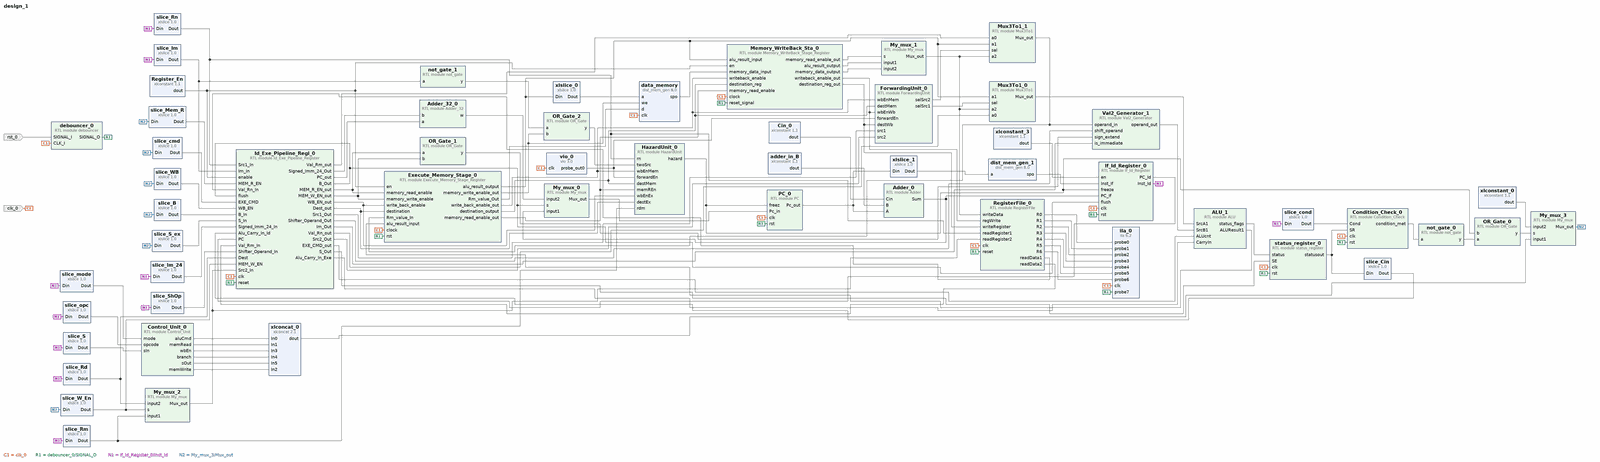
[diagram p0: block diagram of the top level, whole]
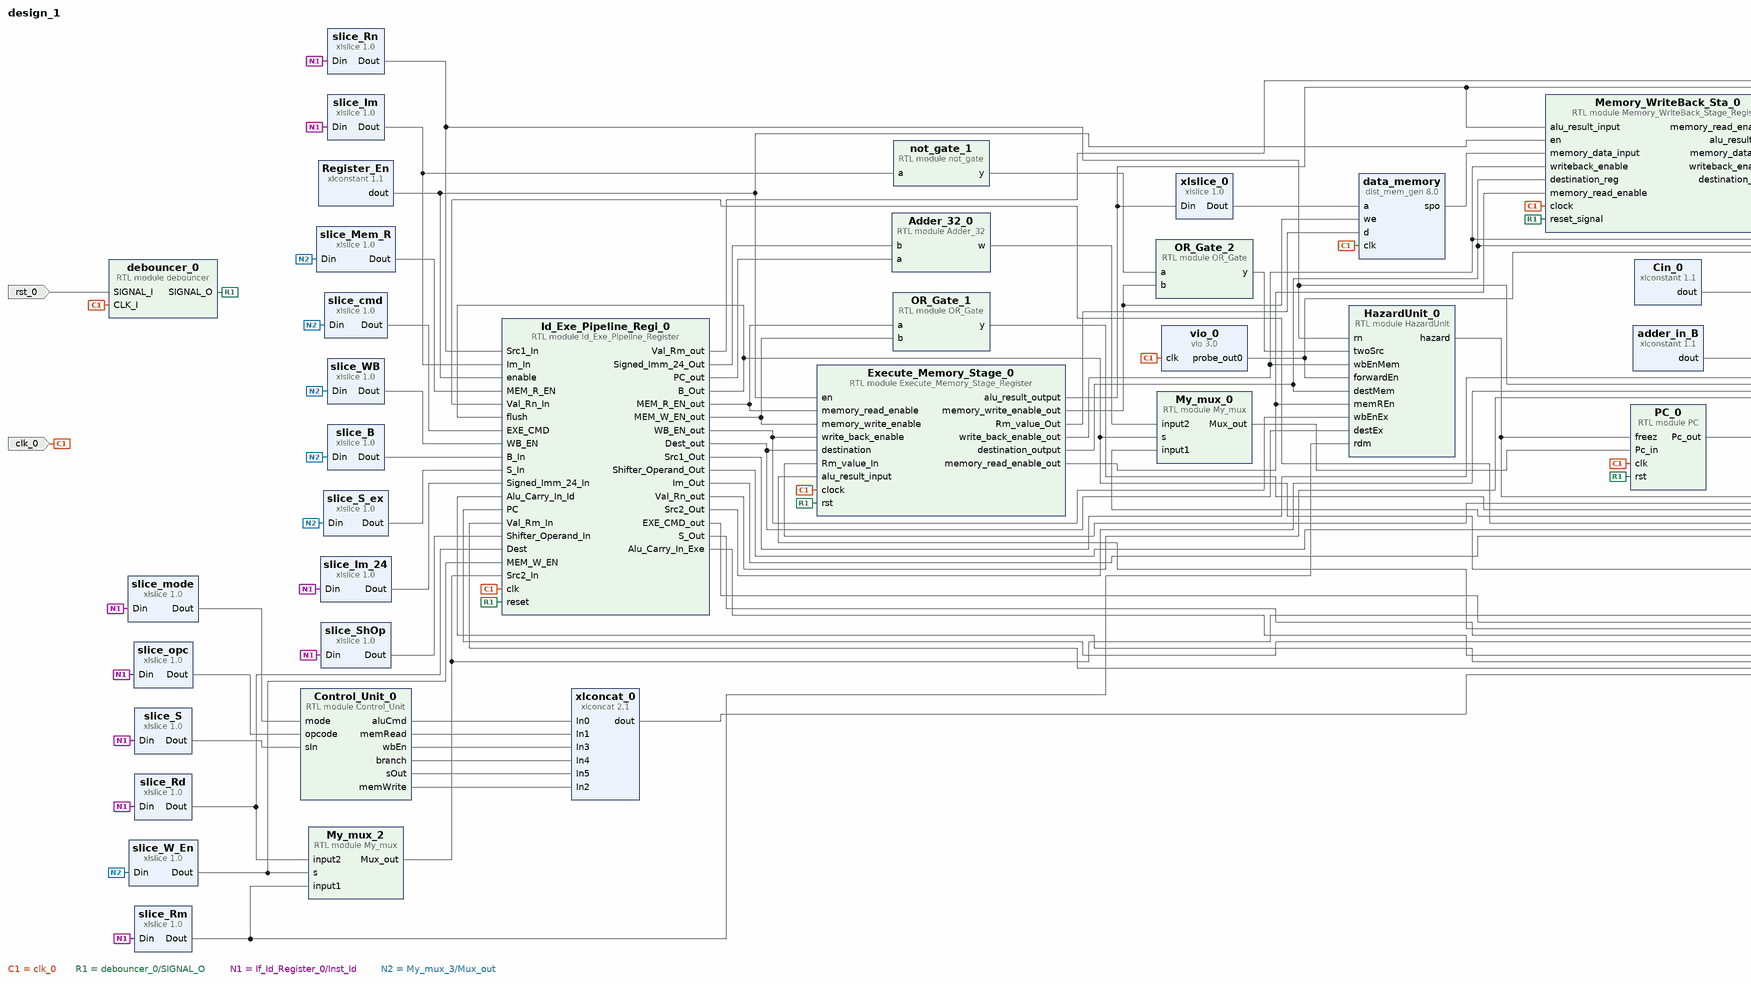
[diagram p1: block diagram of the top level, left part]
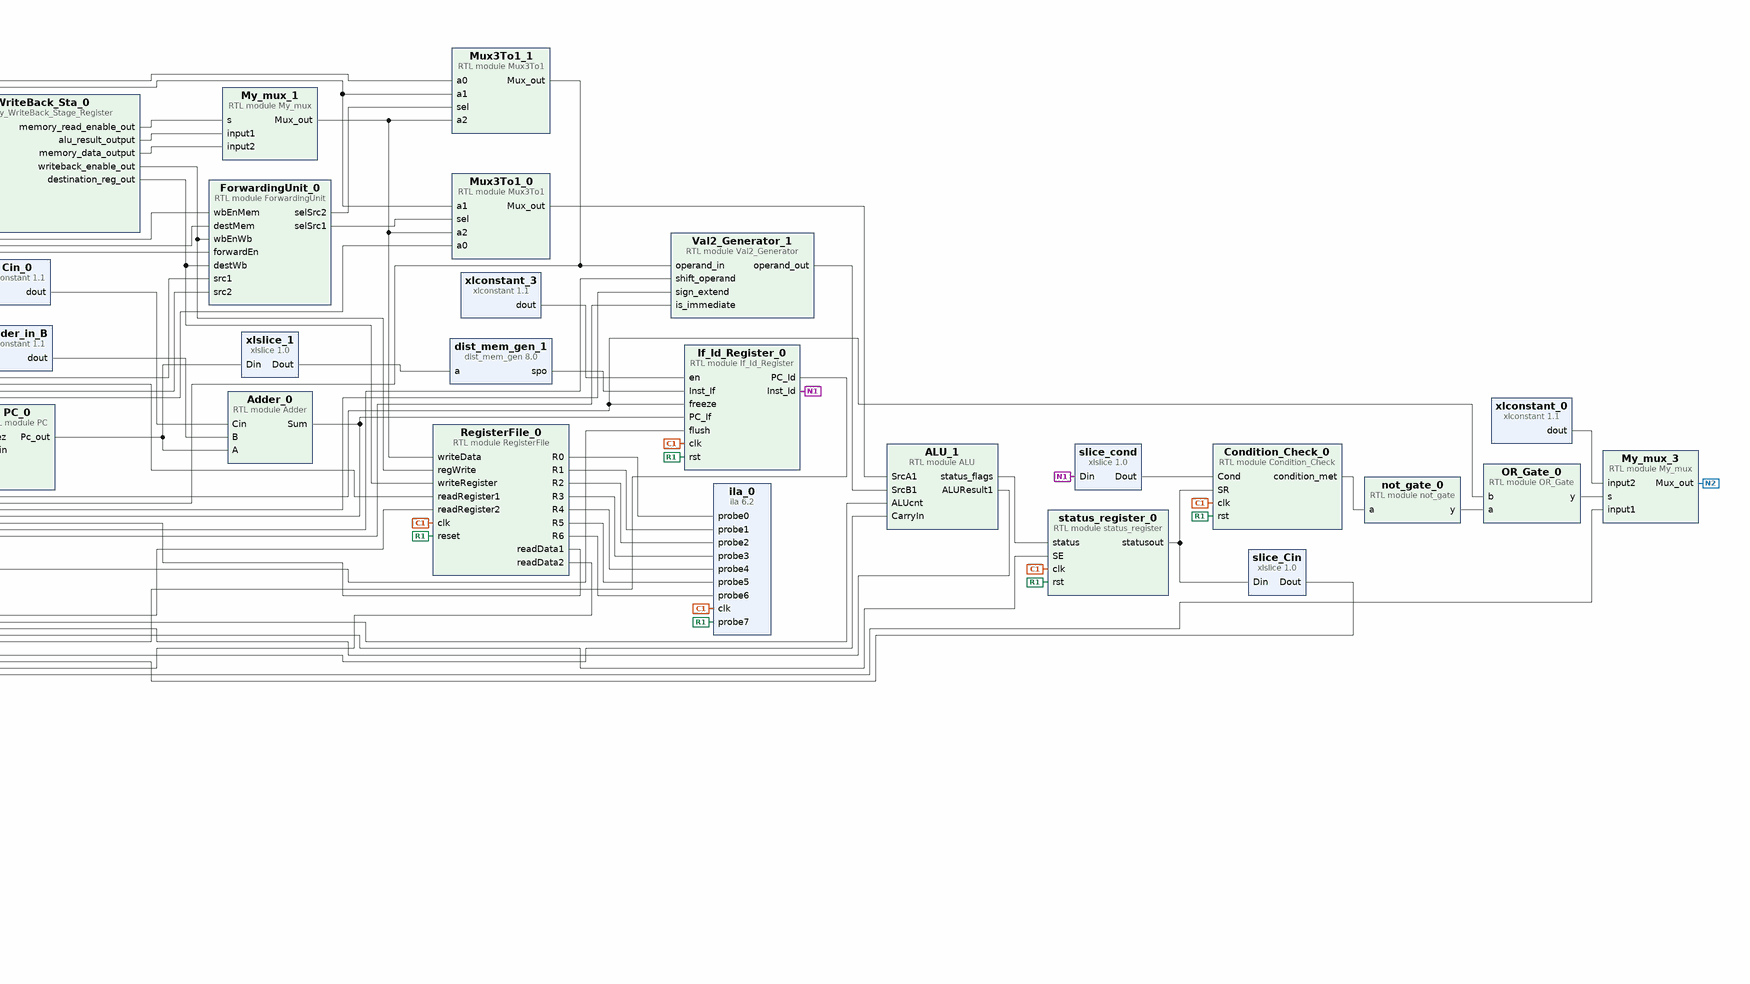
[diagram p2: block diagram of the top level, right part]
# Vivado block design design_1, xc7z010clg400-1, Vivado 2018.3
create_bd_design design_1

create_bd_port -dir I -type clk clk_0
set_property -dict {CONFIG.ASSOCIATED_RESET rst_0} [get_bd_ports clk_0]
create_bd_port -dir I -type rst rst_0

create_bd_cell -type ip -vlnv xilinx.com:ip:xlconstant:1.1 xlconstant_3
create_bd_cell -type ip -vlnv xilinx.com:ip:xlslice:1.0 slice_mode
set_property -dict {CONFIG.DIN_FROM 27 CONFIG.DIN_TO 26 CONFIG.DOUT_WIDTH 2} [get_bd_cells slice_mode]
create_bd_cell -type ip -vlnv xilinx.com:ip:xlslice:1.0 slice_opc
set_property -dict {CONFIG.DIN_FROM 24 CONFIG.DIN_TO 21 CONFIG.DOUT_WIDTH 4} [get_bd_cells slice_opc]
create_bd_cell -type ip -vlnv xilinx.com:ip:xlslice:1.0 slice_S
set_property -dict {CONFIG.DIN_FROM 20 CONFIG.DIN_TO 20 CONFIG.DOUT_WIDTH 1} [get_bd_cells slice_S]
create_bd_cell -type module -reference status_register status_register_0
create_bd_cell -type ip -vlnv xilinx.com:ip:xlslice:1.0 slice_cond
set_property -dict {CONFIG.DIN_FROM 31 CONFIG.DIN_TO 28 CONFIG.DOUT_WIDTH 4} [get_bd_cells slice_cond]
create_bd_cell -type ip -vlnv xilinx.com:ip:xlslice:1.0 slice_Rn
set_property -dict {CONFIG.DIN_FROM 19 CONFIG.DIN_TO 16 CONFIG.DOUT_WIDTH 4} [get_bd_cells slice_Rn]
create_bd_cell -type ip -vlnv xilinx.com:ip:xlslice:1.0 slice_Rd
set_property -dict {CONFIG.DIN_FROM 15 CONFIG.DIN_TO 12 CONFIG.DOUT_WIDTH 4} [get_bd_cells slice_Rd]
create_bd_cell -type ip -vlnv xilinx.com:ip:xlconstant:1.1 xlconstant_0
set_property -dict {CONFIG.CONST_VAL 0 CONFIG.CONST_WIDTH 9} [get_bd_cells xlconstant_0]
create_bd_cell -type ip -vlnv xilinx.com:ip:xlconcat:2.1 xlconcat_0
set_property -dict {CONFIG.IN0_WIDTH 4 CONFIG.NUM_PORTS 6} [get_bd_cells xlconcat_0]
create_bd_cell -type module -reference not_gate not_gate_0
create_bd_cell -type module -reference OR_Gate OR_Gate_0
create_bd_cell -type ip -vlnv xilinx.com:ip:xlslice:1.0 slice_Im_24
set_property -dict {CONFIG.DIN_FROM 23 CONFIG.DOUT_WIDTH 24} [get_bd_cells slice_Im_24]
create_bd_cell -type module -reference OR_Gate OR_Gate_1
create_bd_cell -type ip -vlnv xilinx.com:ip:xlslice:1.0 slice_W_En
set_property -dict {CONFIG.DIN_FROM 5 CONFIG.DIN_TO 5 CONFIG.DIN_WIDTH 9 CONFIG.DOUT_WIDTH 1} [get_bd_cells slice_W_En]
create_bd_cell -type ip -vlnv xilinx.com:ip:xlslice:1.0 slice_cmd
set_property -dict {CONFIG.DIN_FROM 3 CONFIG.DIN_TO 0 CONFIG.DIN_WIDTH 9 CONFIG.DOUT_WIDTH 4} [get_bd_cells slice_cmd]
create_bd_cell -type ip -vlnv xilinx.com:ip:xlslice:1.0 slice_S_ex
set_property -dict {CONFIG.DIN_FROM 8 CONFIG.DIN_TO 8 CONFIG.DIN_WIDTH 9 CONFIG.DOUT_WIDTH 1} [get_bd_cells slice_S_ex]
create_bd_cell -type ip -vlnv xilinx.com:ip:xlslice:1.0 slice_B
set_property -dict {CONFIG.DIN_FROM 7 CONFIG.DIN_TO 7 CONFIG.DIN_WIDTH 9 CONFIG.DOUT_WIDTH 1} [get_bd_cells slice_B]
create_bd_cell -type ip -vlnv xilinx.com:ip:xlslice:1.0 slice_WB
set_property -dict {CONFIG.DIN_FROM 6 CONFIG.DIN_TO 6 CONFIG.DIN_WIDTH 9 CONFIG.DOUT_WIDTH 1} [get_bd_cells slice_WB]
create_bd_cell -type ip -vlnv xilinx.com:ip:xlslice:1.0 slice_Mem_R
set_property -dict {CONFIG.DIN_FROM 4 CONFIG.DIN_TO 4 CONFIG.DIN_WIDTH 9 CONFIG.DOUT_WIDTH 1} [get_bd_cells slice_Mem_R]
create_bd_cell -type ip -vlnv xilinx.com:ip:xlslice:1.0 slice_Im
set_property -dict {CONFIG.DIN_FROM 25 CONFIG.DIN_TO 25 CONFIG.DOUT_WIDTH 1} [get_bd_cells slice_Im]
create_bd_cell -type ip -vlnv xilinx.com:ip:xlslice:1.0 slice_ShOp
set_property -dict {CONFIG.DIN_FROM 11 CONFIG.DOUT_WIDTH 12} [get_bd_cells slice_ShOp]
create_bd_cell -type ip -vlnv xilinx.com:ip:xlconstant:1.1 Register_En
create_bd_cell -type ip -vlnv xilinx.com:ip:xlslice:1.0 slice_Cin
set_property -dict {CONFIG.DIN_FROM 1 CONFIG.DIN_TO 1 CONFIG.DIN_WIDTH 4 CONFIG.DOUT_WIDTH 1} [get_bd_cells slice_Cin]
create_bd_cell -type ip -vlnv xilinx.com:ip:dist_mem_gen:8.0 data_memory
set_property -dict {CONFIG.data_width 32 CONFIG.depth 8192} [get_bd_cells data_memory]
create_bd_cell -type ip -vlnv xilinx.com:ip:dist_mem_gen:8.0 dist_mem_gen_1
set_property -dict [list \
  CONFIG.coefficient_file ../../../../../../../OneDrive/Desktop/ultimate.coe \
  CONFIG.data_width 32 \
  CONFIG.depth 8192 \
  CONFIG.memory_type rom \
] [get_bd_cells dist_mem_gen_1]
create_bd_cell -type module -reference not_gate not_gate_1
create_bd_cell -type module -reference OR_Gate OR_Gate_2
create_bd_cell -type module -reference Control_Unit Control_Unit_0
create_bd_cell -type ip -vlnv xilinx.com:ip:xlslice:1.0 slice_Rm
set_property -dict {CONFIG.DIN_FROM 3 CONFIG.DOUT_WIDTH 4} [get_bd_cells slice_Rm]
create_bd_cell -type ip -vlnv xilinx.com:ip:xlconstant:1.1 Cin_0
set_property -dict {CONFIG.CONST_VAL 0} [get_bd_cells Cin_0]
create_bd_cell -type ip -vlnv xilinx.com:ip:xlconstant:1.1 adder_in_B
set_property -dict {CONFIG.CONST_WIDTH 32} [get_bd_cells adder_in_B]
create_bd_cell -type module -reference Execute_Memory_Stage_Register Execute_Memory_Stage_0
create_bd_cell -type module -reference Val2_Generator Val2_Generator_1
create_bd_cell -type module -reference Id_Exe_Pipeline_Register Id_Exe_Pipeline_Regi_0
create_bd_cell -type module -reference My_mux My_mux_1
create_bd_cell -type module -reference My_mux My_mux_0
create_bd_cell -type module -reference My_mux My_mux_2
set_property -dict {CONFIG.WIDTH 4} [get_bd_cells My_mux_2]
create_bd_cell -type module -reference My_mux My_mux_3
set_property -dict {CONFIG.WIDTH 9} [get_bd_cells My_mux_3]
create_bd_cell -type module -reference Adder_32 Adder_32_0
create_bd_cell -type module -reference ALU ALU_1
create_bd_cell -type ip -vlnv xilinx.com:ip:xlslice:1.0 xlslice_0
set_property -dict {CONFIG.DIN_FROM 12 CONFIG.DOUT_WIDTH 13} [get_bd_cells xlslice_0]
create_bd_cell -type ip -vlnv xilinx.com:ip:xlslice:1.0 xlslice_1
set_property -dict {CONFIG.DIN_FROM 12 CONFIG.DOUT_WIDTH 13} [get_bd_cells xlslice_1]
create_bd_cell -type module -reference Condition_Check Condition_Check_0
create_bd_cell -type module -reference Adder Adder_0
create_bd_cell -type module -reference PC PC_0
create_bd_cell -type module -reference Memory_WriteBack_Stage_Register Memory_WriteBack_Sta_0
create_bd_cell -type module -reference If_Id_Register If_Id_Register_0
create_bd_cell -type module -reference ForwardingUnit ForwardingUnit_0
create_bd_cell -type module -reference Mux3To1 Mux3To1_0
create_bd_cell -type module -reference Mux3To1 Mux3To1_1
create_bd_cell -type module -reference HazardUnit HazardUnit_0
create_bd_cell -type module -reference debouncer debouncer_0
create_bd_cell -type ip -vlnv xilinx.com:ip:ila:6.2 ila_0
set_property -dict [list \
  CONFIG.C_ENABLE_ILA_AXI_MON false \
  CONFIG.C_MONITOR_TYPE Native \
  CONFIG.C_NUM_OF_PROBES 8 \
  CONFIG.C_PROBE0_TYPE 1 \
  CONFIG.C_PROBE0_WIDTH 32 \
  CONFIG.C_PROBE1_TYPE 1 \
  CONFIG.C_PROBE1_WIDTH 32 \
  CONFIG.C_PROBE2_TYPE 1 \
  CONFIG.C_PROBE2_WIDTH 32 \
  CONFIG.C_PROBE3_TYPE 1 \
  CONFIG.C_PROBE3_WIDTH 32 \
  CONFIG.C_PROBE4_TYPE 1 \
  CONFIG.C_PROBE4_WIDTH 32 \
  CONFIG.C_PROBE5_TYPE 1 \
  CONFIG.C_PROBE5_WIDTH 32 \
  CONFIG.C_PROBE6_TYPE 1 \
  CONFIG.C_PROBE6_WIDTH 32 \
  CONFIG.C_PROBE7_TYPE 2 \
] [get_bd_cells ila_0]
create_bd_cell -type module -reference RegisterFile RegisterFile_0
create_bd_cell -type ip -vlnv xilinx.com:ip:vio:3.0 vio_0
set_property -dict {CONFIG.C_NUM_PROBE_IN 0} [get_bd_cells vio_0]

# ---- connections ----

connect_bd_net -net clk_0_1 [get_bd_ports clk_0] \
  [get_bd_pins status_register_0/clk] [get_bd_pins data_memory/clk] [get_bd_pins Execute_Memory_Stage_0/clock] \
  [get_bd_pins Id_Exe_Pipeline_Regi_0/clk] [get_bd_pins Condition_Check_0/clk] [get_bd_pins PC_0/clk] \
  [get_bd_pins Memory_WriteBack_Sta_0/clock] [get_bd_pins If_Id_Register_0/clk] [get_bd_pins debouncer_0/CLK_I] \
  [get_bd_pins ila_0/clk] [get_bd_pins RegisterFile_0/clk] [get_bd_pins vio_0/clk]
connect_bd_net -net rst_0_1 [get_bd_pins debouncer_0/SIGNAL_O] \
  [get_bd_pins status_register_0/rst] [get_bd_pins Execute_Memory_Stage_0/rst] [get_bd_pins Id_Exe_Pipeline_Regi_0/reset] \
  [get_bd_pins Condition_Check_0/rst] [get_bd_pins PC_0/rst] [get_bd_pins Memory_WriteBack_Sta_0/reset_signal] \
  [get_bd_pins If_Id_Register_0/rst] [get_bd_pins ila_0/probe7] [get_bd_pins RegisterFile_0/reset]
connect_bd_net -net IF_0_pc_out [get_bd_pins Adder_0/Sum] [get_bd_pins My_mux_0/input1] [get_bd_pins If_Id_Register_0/PC_If]
connect_bd_net [get_bd_pins xlconstant_3/dout] [get_bd_pins If_Id_Register_0/en]
connect_bd_net -net if_id_out_1 [get_bd_pins If_Id_Register_0/Inst_Id] \
  [get_bd_pins slice_mode/Din] [get_bd_pins slice_opc/Din] [get_bd_pins slice_S/Din] [get_bd_pins slice_cond/Din] \
  [get_bd_pins slice_Rn/Din] [get_bd_pins slice_Rd/Din] [get_bd_pins slice_Im_24/Din] [get_bd_pins slice_Im/Din] \
  [get_bd_pins slice_ShOp/Din] [get_bd_pins slice_Rm/Din]
connect_bd_net -net xlslice_0_Dout [get_bd_pins slice_mode/Dout] [get_bd_pins Control_Unit_0/mode]
connect_bd_net -net xlslice_1_Dout [get_bd_pins slice_opc/Dout] [get_bd_pins Control_Unit_0/opcode]
connect_bd_net -net xlslice_0_Dout1 [get_bd_pins slice_S/Dout] [get_bd_pins Control_Unit_0/sIn]
connect_bd_net [get_bd_pins slice_cond/Dout] [get_bd_pins Condition_Check_0/Cond]
connect_bd_net [get_bd_pins status_register_0/statusout] [get_bd_pins slice_Cin/Din] [get_bd_pins Condition_Check_0/SR]
connect_bd_net [get_bd_pins slice_Rn/Dout] \
  [get_bd_pins Id_Exe_Pipeline_Regi_0/Src1_In] [get_bd_pins HazardUnit_0/rn] [get_bd_pins RegisterFile_0/readRegister1]
connect_bd_net -net xlslice_0_Dout2 [get_bd_pins slice_Rd/Dout] [get_bd_pins Id_Exe_Pipeline_Regi_0/Dest] [get_bd_pins My_mux_2/input2]
connect_bd_net -net Mux_0_out [get_bd_pins My_mux_2/Mux_out] [get_bd_pins Id_Exe_Pipeline_Regi_0/Src2_In] [get_bd_pins RegisterFile_0/readRegister2]
connect_bd_net [get_bd_pins xlconstant_0/dout] [get_bd_pins My_mux_3/input2]
connect_bd_net -net Control_Unit_0_EXE_CMD [get_bd_pins Control_Unit_0/aluCmd] [get_bd_pins xlconcat_0/In0]
connect_bd_net -net Control_Unit_0_MEM_R_EN [get_bd_pins Control_Unit_0/memRead] [get_bd_pins xlconcat_0/In1]
connect_bd_net -net Control_Unit_0_WB_EN [get_bd_pins Control_Unit_0/wbEn] [get_bd_pins xlconcat_0/In3]
connect_bd_net -net Control_Unit_0_B [get_bd_pins Control_Unit_0/branch] [get_bd_pins xlconcat_0/In4]
connect_bd_net -net Control_Unit_0_S_Out [get_bd_pins Control_Unit_0/sOut] [get_bd_pins xlconcat_0/In5]
connect_bd_net [get_bd_pins xlconcat_0/dout] [get_bd_pins My_mux_3/input1]
connect_bd_net [get_bd_pins Condition_Check_0/condition_met] [get_bd_pins not_gate_0/a]
connect_bd_net [get_bd_pins not_gate_0/y] [get_bd_pins OR_Gate_0/a]
connect_bd_net -net Mux_1_out [get_bd_pins My_mux_3/Mux_out] \
  [get_bd_pins slice_cmd/Din] [get_bd_pins slice_Mem_R/Din] [get_bd_pins slice_W_En/Din] [get_bd_pins slice_WB/Din] \
  [get_bd_pins slice_B/Din] [get_bd_pins slice_S_ex/Din]
connect_bd_net -net slice_mem_R_En_exe_Dout [get_bd_pins slice_Mem_R/Dout] [get_bd_pins Id_Exe_Pipeline_Regi_0/MEM_R_EN]
connect_bd_net [get_bd_pins Register_En/dout] \
  [get_bd_pins Execute_Memory_Stage_0/en] [get_bd_pins Id_Exe_Pipeline_Regi_0/enable] [get_bd_pins Memory_WriteBack_Sta_0/en]
connect_bd_net -net slice_exe_cmd_exe_Dout [get_bd_pins slice_cmd/Dout] [get_bd_pins Id_Exe_Pipeline_Regi_0/EXE_CMD]
connect_bd_net -net slice_mem_W_En_exe_Dout [get_bd_pins slice_W_En/Dout] [get_bd_pins Id_Exe_Pipeline_Regi_0/MEM_W_EN] [get_bd_pins My_mux_2/s]
connect_bd_net -net slice_WB_En_exe_Dout [get_bd_pins slice_WB/Dout] [get_bd_pins Id_Exe_Pipeline_Regi_0/WB_EN]
connect_bd_net -net slice_B_Exe_Dout [get_bd_pins slice_B/Dout] [get_bd_pins Id_Exe_Pipeline_Regi_0/B_In]
connect_bd_net -net Slice_S_exe_Dout [get_bd_pins slice_S_ex/Dout] [get_bd_pins Id_Exe_Pipeline_Regi_0/S_In]
connect_bd_net [get_bd_pins RegisterFile_0/readData1] [get_bd_pins Id_Exe_Pipeline_Regi_0/Val_Rn_In]
connect_bd_net [get_bd_pins slice_Im_24/Dout] [get_bd_pins Id_Exe_Pipeline_Regi_0/Signed_Imm_24_In]
connect_bd_net [get_bd_pins slice_ShOp/Dout] [get_bd_pins Id_Exe_Pipeline_Regi_0/Shifter_Operand_In]
connect_bd_net [get_bd_pins Id_Exe_Pipeline_Regi_0/Val_Rm_out] [get_bd_pins Mux3To1_1/a0]
connect_bd_net [get_bd_pins Id_Exe_Pipeline_Regi_0/Shifter_Operand_Out] [get_bd_pins Val2_Generator_1/shift_operand]
connect_bd_net [get_bd_pins slice_Im/Dout] [get_bd_pins not_gate_1/a] [get_bd_pins Id_Exe_Pipeline_Regi_0/Im_In]
connect_bd_net [get_bd_pins Id_Exe_Pipeline_Regi_0/Im_Out] [get_bd_pins Val2_Generator_1/is_immediate]
connect_bd_net [get_bd_pins OR_Gate_1/y] [get_bd_pins Val2_Generator_1/sign_extend]
connect_bd_net [get_bd_pins Id_Exe_Pipeline_Regi_0/MEM_R_EN_out] [get_bd_pins OR_Gate_1/a] [get_bd_pins Execute_Memory_Stage_0/memory_read_enable]
connect_bd_net [get_bd_pins Id_Exe_Pipeline_Regi_0/MEM_W_EN_out] [get_bd_pins OR_Gate_1/b] [get_bd_pins Execute_Memory_Stage_0/memory_write_enable]
connect_bd_net [get_bd_pins Id_Exe_Pipeline_Regi_0/Val_Rn_out] [get_bd_pins Mux3To1_0/a0]
connect_bd_net [get_bd_pins Id_Exe_Pipeline_Regi_0/EXE_CMD_out] [get_bd_pins ALU_1/ALUcnt]
connect_bd_net [get_bd_pins Id_Exe_Pipeline_Regi_0/Signed_Imm_24_Out] [get_bd_pins Adder_32_0/b]
connect_bd_net [get_bd_pins Id_Exe_Pipeline_Regi_0/PC_out] [get_bd_pins Adder_32_0/a]
connect_bd_net [get_bd_pins Id_Exe_Pipeline_Regi_0/S_Out] [get_bd_pins status_register_0/SE]
connect_bd_net [get_bd_pins ALU_1/status_flags] [get_bd_pins status_register_0/status]
connect_bd_net [get_bd_pins Id_Exe_Pipeline_Regi_0/WB_EN_out] [get_bd_pins Execute_Memory_Stage_0/write_back_enable] [get_bd_pins HazardUnit_0/wbEnEx]
connect_bd_net -net Exe_Mem_Pipeline_Reg_0_WB_EN_Out [get_bd_pins Execute_Memory_Stage_0/write_back_enable_out] \
  [get_bd_pins Memory_WriteBack_Sta_0/writeback_enable] [get_bd_pins ForwardingUnit_0/wbEnMem] \
  [get_bd_pins HazardUnit_0/wbEnMem]
connect_bd_net -net Exe_Mem_Pipeline_Reg_0_Alu_Res_Out [get_bd_pins Execute_Memory_Stage_0/alu_result_output] \
  [get_bd_pins xlslice_0/Din] [get_bd_pins Memory_WriteBack_Sta_0/alu_result_input] [get_bd_pins Mux3To1_0/a1] \
  [get_bd_pins Mux3To1_1/a1]
connect_bd_net [get_bd_pins ALU_1/ALUResult1] [get_bd_pins Execute_Memory_Stage_0/alu_result_input]
connect_bd_net [get_bd_pins slice_Cin/Dout] [get_bd_pins Id_Exe_Pipeline_Regi_0/Alu_Carry_In_Id]
connect_bd_net [get_bd_pins dist_mem_gen_1/spo] [get_bd_pins If_Id_Register_0/Inst_If]
connect_bd_net -net Exe_Mem_Pipeline_Reg_0_MEM_W_EN_out [get_bd_pins Execute_Memory_Stage_0/memory_write_enable_out] \
  [get_bd_pins data_memory/we] [get_bd_pins OR_Gate_2/b]
connect_bd_net [get_bd_pins data_memory/spo] [get_bd_pins Memory_WriteBack_Sta_0/memory_data_input]
connect_bd_net [get_bd_pins Id_Exe_Pipeline_Regi_0/Dest_out] [get_bd_pins Execute_Memory_Stage_0/destination] [get_bd_pins HazardUnit_0/destEx]
connect_bd_net -net Exe_Mem_Pipeline_Reg_0_Dest_out [get_bd_pins Execute_Memory_Stage_0/destination_output] \
  [get_bd_pins Memory_WriteBack_Sta_0/destination_reg] [get_bd_pins ForwardingUnit_0/destMem] \
  [get_bd_pins HazardUnit_0/destMem]
connect_bd_net [get_bd_pins not_gate_1/y] [get_bd_pins OR_Gate_2/a]
connect_bd_net [get_bd_pins OR_Gate_2/y] [get_bd_pins HazardUnit_0/twoSrc]
connect_bd_net -net Hazard_unit_0_hazard_Detected [get_bd_pins HazardUnit_0/hazard] \
  [get_bd_pins OR_Gate_0/b] [get_bd_pins PC_0/freez] [get_bd_pins If_Id_Register_0/freeze]
connect_bd_net [get_bd_pins Id_Exe_Pipeline_Regi_0/B_Out] \
  [get_bd_pins Id_Exe_Pipeline_Regi_0/flush] [get_bd_pins My_mux_0/s] [get_bd_pins If_Id_Register_0/flush]
connect_bd_net [get_bd_pins Id_Exe_Pipeline_Regi_0/Alu_Carry_In_Exe] [get_bd_pins ALU_1/CarryIn]
connect_bd_net [get_bd_pins Control_Unit_0/memWrite] [get_bd_pins xlconcat_0/In2]
connect_bd_net [get_bd_pins slice_Rm/Dout] [get_bd_pins My_mux_2/input1] [get_bd_pins HazardUnit_0/rdm]
connect_bd_net [get_bd_pins PC_0/Pc_out] [get_bd_pins xlslice_1/Din] [get_bd_pins Adder_0/A]
connect_bd_net [get_bd_pins Adder_32_0/w] [get_bd_pins My_mux_0/input2]
connect_bd_net [get_bd_pins Cin_0/dout] [get_bd_pins Adder_0/Cin]
connect_bd_net -net xlconstant_1_dout [get_bd_pins adder_in_B/dout] [get_bd_pins Adder_0/B]
connect_bd_net [get_bd_pins OR_Gate_0/y] [get_bd_pins My_mux_3/s]
connect_bd_net [get_bd_pins Execute_Memory_Stage_0/memory_read_enable_out] \
  [get_bd_pins Memory_WriteBack_Sta_0/memory_read_enable] [get_bd_pins HazardUnit_0/memREn]
connect_bd_net [get_bd_pins Execute_Memory_Stage_0/Rm_value_Out] [get_bd_pins data_memory/d]
connect_bd_net [get_bd_pins Memory_WriteBack_Sta_0/writeback_enable_out] [get_bd_pins ForwardingUnit_0/wbEnWb] [get_bd_pins RegisterFile_0/regWrite]
connect_bd_net [get_bd_pins Memory_WriteBack_Sta_0/memory_read_enable_out] [get_bd_pins My_mux_1/s]
connect_bd_net [get_bd_pins Memory_WriteBack_Sta_0/destination_reg_out] \
  [get_bd_pins ForwardingUnit_0/destWb] [get_bd_pins RegisterFile_0/writeRegister]
connect_bd_net [get_bd_pins Memory_WriteBack_Sta_0/alu_result_output] [get_bd_pins My_mux_1/input1]
connect_bd_net [get_bd_pins Memory_WriteBack_Sta_0/memory_data_output] [get_bd_pins My_mux_1/input2]
connect_bd_net [get_bd_pins Val2_Generator_1/operand_out] [get_bd_pins ALU_1/SrcB1]
connect_bd_net -net My_mux_1_out [get_bd_pins My_mux_1/Mux_out] \
  [get_bd_pins Mux3To1_0/a2] [get_bd_pins Mux3To1_1/a2] [get_bd_pins RegisterFile_0/writeData]
connect_bd_net [get_bd_pins If_Id_Register_0/PC_Id] [get_bd_pins Id_Exe_Pipeline_Regi_0/PC]
connect_bd_net [get_bd_pins ForwardingUnit_0/selSrc1] [get_bd_pins Mux3To1_0/sel]
connect_bd_net [get_bd_pins ForwardingUnit_0/selSrc2] [get_bd_pins Mux3To1_1/sel]
connect_bd_net [get_bd_pins Id_Exe_Pipeline_Regi_0/Src1_Out] [get_bd_pins ForwardingUnit_0/src1]
connect_bd_net [get_bd_pins Id_Exe_Pipeline_Regi_0/Src2_Out] [get_bd_pins ForwardingUnit_0/src2]
connect_bd_net [get_bd_pins My_mux_0/Mux_out] [get_bd_pins PC_0/Pc_in]
connect_bd_net [get_bd_pins Mux3To1_0/Mux_out] [get_bd_pins ALU_1/SrcA1]
connect_bd_net -net xlconstant_1_dout1 [get_bd_pins vio_0/probe_out0] [get_bd_pins ForwardingUnit_0/forwardEn] [get_bd_pins HazardUnit_0/forwardEn]
connect_bd_net [get_bd_pins Mux3To1_1/Mux_out] [get_bd_pins Execute_Memory_Stage_0/Rm_value_In] [get_bd_pins Val2_Generator_1/operand_in]
connect_bd_net [get_bd_pins RegisterFile_0/readData2] [get_bd_pins Id_Exe_Pipeline_Regi_0/Val_Rm_In]
connect_bd_net -net rst_0_2 [get_bd_ports rst_0] [get_bd_pins debouncer_0/SIGNAL_I]
connect_bd_net [get_bd_pins xlslice_0/Dout] [get_bd_pins data_memory/a]
connect_bd_net [get_bd_pins xlslice_1/Dout] [get_bd_pins dist_mem_gen_1/a]
connect_bd_net [get_bd_pins RegisterFile_0/R0] [get_bd_pins ila_0/probe0]
connect_bd_net [get_bd_pins RegisterFile_0/R1] [get_bd_pins ila_0/probe1]
connect_bd_net [get_bd_pins RegisterFile_0/R2] [get_bd_pins ila_0/probe2]
connect_bd_net [get_bd_pins RegisterFile_0/R3] [get_bd_pins ila_0/probe3]
connect_bd_net [get_bd_pins RegisterFile_0/R4] [get_bd_pins ila_0/probe4]
connect_bd_net [get_bd_pins RegisterFile_0/R5] [get_bd_pins ila_0/probe5]
connect_bd_net [get_bd_pins RegisterFile_0/R6] [get_bd_pins ila_0/probe6]

validate_bd_design
save_bd_design
